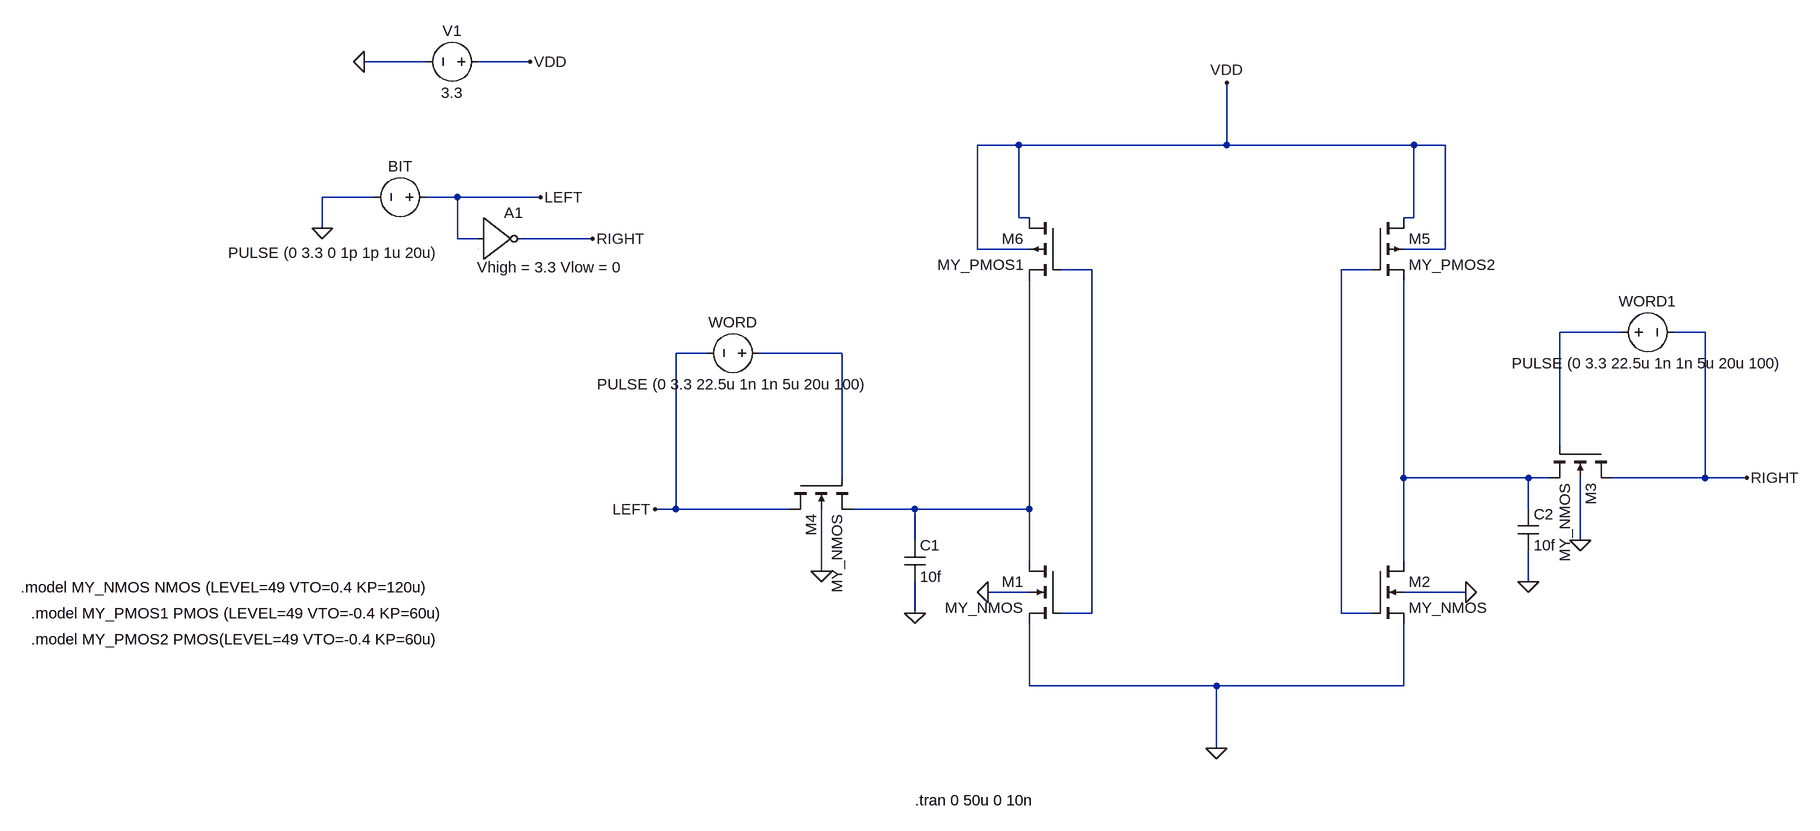
[diagram p0: schematic sram_6t_cell.asc]
sram_6t_cell.asc, the LTspice schematic file:
Version 4.1
SHEET 1 1500 784
WIRE -624 -368 -720 -368
WIRE -464 -368 -544 -368
WIRE 288 -240 224 -240
WIRE 608 -240 608 -336
WIRE 608 -240 288 -240
WIRE 896 -240 608 -240
WIRE 944 -240 896 -240
WIRE -704 -160 -784 -160
WIRE -576 -160 -624 -160
WIRE -448 -160 -576 -160
WIRE 288 -128 288 -240
WIRE 304 -128 288 -128
WIRE 896 -128 896 -240
WIRE 896 -128 880 -128
WIRE -784 -112 -784 -160
WIRE -576 -96 -576 -160
WIRE -544 -96 -576 -96
WIRE -368 -96 -480 -96
WIRE 224 -80 224 -240
WIRE 304 -80 224 -80
WIRE 944 -80 944 -240
WIRE 944 -80 880 -80
WIRE 400 -48 352 -48
WIRE 832 -48 784 -48
WIRE 1216 48 1120 48
WIRE 1344 48 1296 48
WIRE -192 80 -240 80
WIRE 16 80 -112 80
WIRE 1120 224 1120 48
WIRE 16 272 16 80
WIRE 880 272 880 -32
WIRE 1072 272 880 272
WIRE 1104 272 1072 272
WIRE 1344 272 1344 48
WIRE 1344 272 1200 272
WIRE 1408 272 1344 272
WIRE -240 320 -240 80
WIRE -240 320 -272 320
WIRE -64 320 -240 320
WIRE 128 320 32 320
WIRE 304 320 304 -32
WIRE 304 320 128 320
WIRE 1072 320 1072 272
WIRE 128 368 128 320
WIRE 1152 368 1152 272
WIRE 304 400 304 320
WIRE 880 400 880 272
WIRE -16 416 -16 320
WIRE 1072 432 1072 384
WIRE 304 448 240 448
WIRE 976 448 880 448
WIRE 128 480 128 432
WIRE 400 480 400 -48
WIRE 400 480 352 480
WIRE 784 480 784 -48
WIRE 832 480 784 480
WIRE 304 592 304 496
WIRE 592 592 304 592
WIRE 880 592 880 496
WIRE 880 592 592 592
WIRE 592 688 592 592
FLAG 592 688 0
FLAG 608 -336 VDD
FLAG 128 480 0
FLAG -272 320 LEFT
FLAG -16 416 0
FLAG 240 448 0
FLAG 976 448 0
FLAG 1152 368 0
FLAG 1408 272 RIGHT
FLAG -784 -112 0
FLAG -448 -160 LEFT
FLAG -368 -96 RIGHT
FLAG -720 -368 0
FLAG -464 -368 VDD
FLAG 1072 432 0
SYMBOL nmos4 352 400 M0
SYMATTR InstName M1
SYMATTR Value MY_NMOS
SYMBOL nmos4 832 400 R0
SYMATTR InstName M2
SYMATTR Value MY_NMOS
SYMBOL nmos4 1200 224 R90
SYMATTR InstName M3
SYMATTR Value MY_NMOS
SYMBOL nmos4 -64 272 M90
SYMATTR InstName M4
SYMATTR Value MY_NMOS
SYMBOL pmos4 832 -128 R0
SYMATTR InstName M5
SYMATTR Value MY_PMOS2
SYMBOL pmos4 352 -128 M0
SYMATTR InstName M6
SYMATTR Value MY_PMOS1
SYMBOL cap 112 368 R0
SYMATTR InstName C1
SYMATTR Value 10f
SYMBOL voltage -96 80 R90
WINDOW 0 -32 56 VBottom 2
WINDOW 3 32 56 VTop 2
SYMATTR InstName WORD
SYMATTR Value PULSE (0 3.3 22.5u 1n 1n 5u 20u 100)
SYMBOL voltage 1200 48 R270
WINDOW 0 32 56 VTop 2
WINDOW 3 -32 56 VBottom 2
SYMATTR InstName WORD1
SYMATTR Value PULSE (0 3.3 22.5u 1n 1n 5u 20u 100)
SYMBOL voltage -528 -368 R90
WINDOW 0 -32 56 VBottom 2
WINDOW 3 32 56 VTop 2
SYMATTR InstName V1
SYMATTR Value 3.3
SYMBOL voltage -608 -160 R90
WINDOW 0 -32 56 VBottom 2
WINDOW 3 70 159 VTop 2
SYMATTR InstName BIT
SYMATTR Value PULSE (0 3.3 0 1p 1p 1u 20u)
SYMBOL Digital\\inv -544 -160 R0
WINDOW 3 -2 108 Left 2
SYMATTR Value Vhigh = 3.3 Vlow = 0
SYMATTR InstName A1
SYMBOL cap 1056 320 R0
SYMATTR InstName C2
SYMATTR Value 10f
TEXT -1248 440 Left 2 !.model MY_NMOS NMOS (LEVEL=49 VTO=0.4 KP=120u)
TEXT -1232 480 Left 2 !.model MY_PMOS1 PMOS (LEVEL=49 VTO=-0.4 KP=60u)
TEXT -1232 520 Left 2 !.model MY_PMOS2 PMOS(LEVEL=49 VTO=-0.4 KP=60u)
TEXT 128 768 Left 2 !.tran 0 50u 0 10n

The netlist it stands for:
* sram_6t_cell.asc
M1 N006 N001 0 0 MY_NMOS
M2 N005 N002 0 0 MY_NMOS
M3 RIGHT N003 N005 0 MY_NMOS
M4 LEFT N004 N006 0 MY_NMOS
M5 VDD N002 N005 VDD MY_PMOS2
M6 VDD N001 N006 VDD MY_PMOS1
C1 N006 0 10f
V§WORD N004 LEFT PULSE (0 3.3 22.5u 1n 1n 5u 20u 100)
V§WORD1 N003 RIGHT PULSE (0 3.3 22.5u 1n 1n 5u 20u 100)
V1 VDD 0 3.3
V§BIT LEFT 0 PULSE (0 3.3 0 1p 1p 1u 20u)
A1 LEFT 0 0 0 0 RIGHT 0 0 BUF Vhigh = 3.3 Vlow = 0
C2 N005 0 10f
.model NMOS NMOS
.model PMOS PMOS
.lib standard.mos
.model MY_NMOS NMOS (LEVEL=49 VTO=0.4 KP=120u)
.model MY_PMOS1 PMOS (LEVEL=49 VTO=-0.4 KP=60u)
.model MY_PMOS2 PMOS(LEVEL=49 VTO=-0.4 KP=60u)
.tran 0 50u 0 10n
.backanno
.end